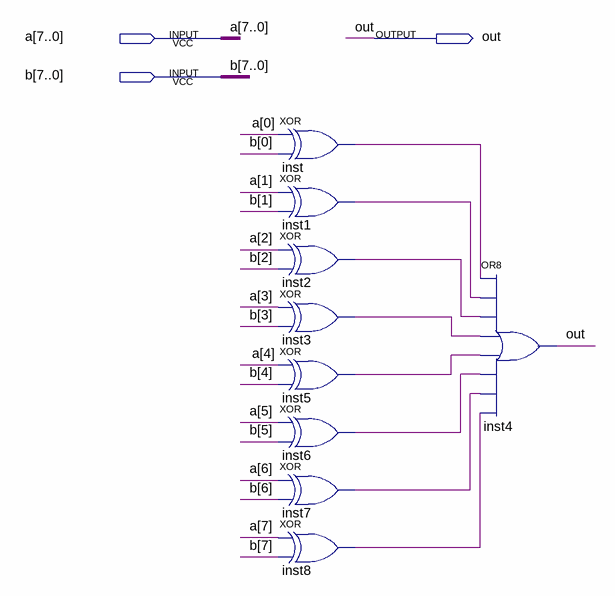
[diagram p0: schematic sheet]
// Quartus schematic equal.bdf as structural Verilog: 9 symbols, 3 pins
module equal (
  input  [7:0] a,
  input  [7:0] b,
  output out
);

  wire inst1_out, inst2_out, inst3_out, inst5_out, inst6_out, inst7_out, inst8_out, inst_out;

  xor inst (inst_out, a[0], b[0]);
  xor inst1 (inst1_out, a[1], b[1]);
  xor inst2 (inst2_out, a[2], b[2]);
  xor inst3 (inst3_out, a[3], b[3]);
  xor inst5 (inst5_out, a[4], b[4]);
  xor inst6 (inst6_out, a[5], b[5]);
  xor inst7 (inst7_out, a[6], b[6]);
  xor inst8 (inst8_out, a[7], b[7]);
  or inst4 (out, inst_out, inst1_out, inst2_out, inst3_out, inst5_out, inst6_out, inst7_out, inst8_out);
endmodule
